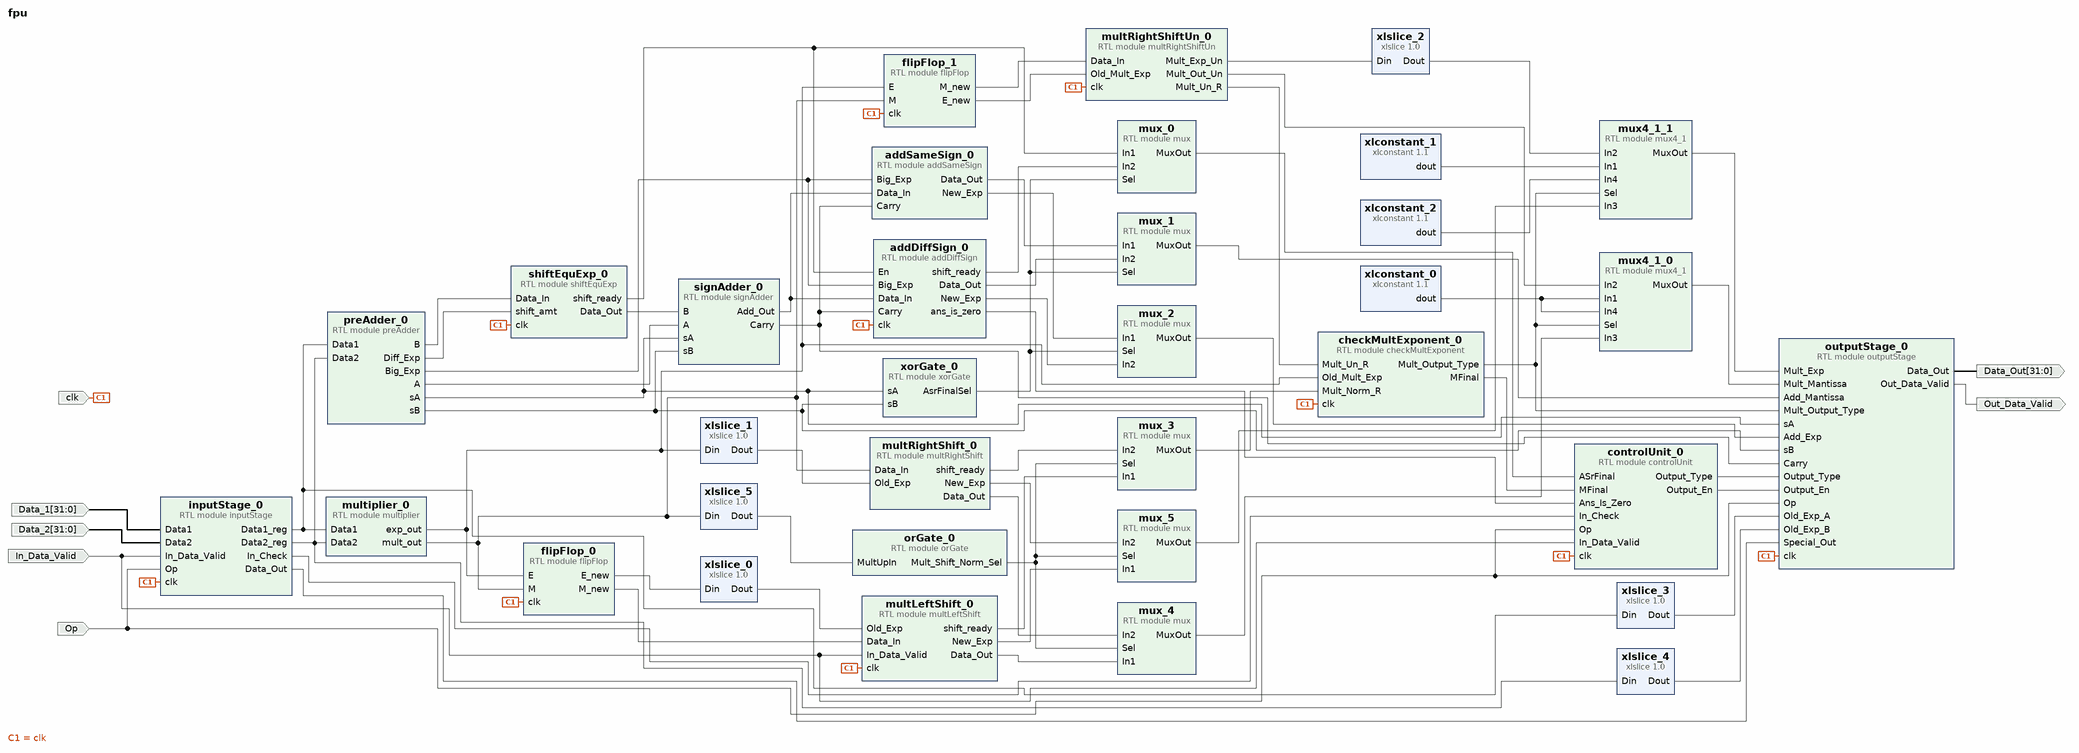
[diagram p0: block diagram of the top level]
# Vivado block design fpu, xc7z020clg400-1, Vivado 2020.2
create_bd_design fpu

create_bd_port -dir I -type clk clk
create_bd_port -dir I -from 31 -to 0 Data_1
create_bd_port -dir I -from 31 -to 0 Data_2
create_bd_port -dir I In_Data_Valid
create_bd_port -dir I Op
create_bd_port -dir O -from 31 -to 0 Data_Out
create_bd_port -dir O Out_Data_Valid

create_bd_cell -type module -reference inputStage inputStage_0
create_bd_cell -type module -reference preAdder preAdder_0
create_bd_cell -type module -reference shiftEquExp shiftEquExp_0
create_bd_cell -type module -reference signAdder signAdder_0
create_bd_cell -type module -reference addDiffSign addDiffSign_0
create_bd_cell -type module -reference addSameSign addSameSign_0
create_bd_cell -type module -reference mux mux_0
set_property -dict {CONFIG.Width 1} [get_bd_cells mux_0]
create_bd_cell -type module -reference mux mux_1
create_bd_cell -type module -reference mux mux_2
set_property -dict {CONFIG.Width 8} [get_bd_cells mux_2]
create_bd_cell -type module -reference controlUnit controlUnit_0
create_bd_cell -type module -reference outputStage outputStage_0
create_bd_cell -type module -reference multiplier multiplier_0
create_bd_cell -type module -reference multLeftShift multLeftShift_0
create_bd_cell -type module -reference multRightShift multRightShift_0
create_bd_cell -type ip -vlnv xilinx.com:ip:xlslice:1.0 xlslice_0
set_property -dict {CONFIG.DIN_FROM 7 CONFIG.DIN_WIDTH 9 CONFIG.DOUT_WIDTH 8} [get_bd_cells xlslice_0]
create_bd_cell -type module -reference mux mux_3
set_property -dict {CONFIG.Width 1} [get_bd_cells mux_3]
create_bd_cell -type module -reference mux mux_4
create_bd_cell -type module -reference mux mux_5
set_property -dict {CONFIG.Width 8} [get_bd_cells mux_5]
create_bd_cell -type module -reference flipFlop flipFlop_0
create_bd_cell -type ip -vlnv xilinx.com:ip:xlslice:1.0 xlslice_1
set_property -dict {CONFIG.DIN_FROM 7 CONFIG.DIN_WIDTH 9 CONFIG.DOUT_WIDTH 8} [get_bd_cells xlslice_1]
create_bd_cell -type module -reference mux4_1 mux4_1_0
create_bd_cell -type module -reference multRightShiftUn multRightShiftUn_0
create_bd_cell -type module -reference flipFlop flipFlop_1
create_bd_cell -type module -reference checkMultExponent checkMultExponent_0
create_bd_cell -type ip -vlnv xilinx.com:ip:xlslice:1.0 xlslice_2
set_property -dict {CONFIG.DIN_FROM 7 CONFIG.DIN_WIDTH 9 CONFIG.DOUT_WIDTH 8} [get_bd_cells xlslice_2]
create_bd_cell -type ip -vlnv xilinx.com:ip:xlconstant:1.1 xlconstant_0
set_property -dict {CONFIG.CONST_VAL 0 CONFIG.CONST_WIDTH 24} [get_bd_cells xlconstant_0]
create_bd_cell -type module -reference mux4_1 mux4_1_1
set_property -dict {CONFIG.Width 8} [get_bd_cells mux4_1_1]
create_bd_cell -type ip -vlnv xilinx.com:ip:xlconstant:1.1 xlconstant_1
set_property -dict {CONFIG.CONST_VAL 0 CONFIG.CONST_WIDTH 8} [get_bd_cells xlconstant_1]
create_bd_cell -type ip -vlnv xilinx.com:ip:xlconstant:1.1 xlconstant_2
set_property -dict {CONFIG.CONST_VAL 255 CONFIG.CONST_WIDTH 8} [get_bd_cells xlconstant_2]
create_bd_cell -type ip -vlnv xilinx.com:ip:xlslice:1.0 xlslice_3
set_property -dict {CONFIG.DIN_FROM 30 CONFIG.DIN_TO 23 CONFIG.DOUT_WIDTH 8} [get_bd_cells xlslice_3]
create_bd_cell -type ip -vlnv xilinx.com:ip:xlslice:1.0 xlslice_4
set_property -dict {CONFIG.DIN_FROM 30 CONFIG.DIN_TO 23 CONFIG.DOUT_WIDTH 8} [get_bd_cells xlslice_4]
create_bd_cell -type ip -vlnv xilinx.com:ip:xlslice:1.0 xlslice_5
set_property -dict {CONFIG.DIN_FROM 47 CONFIG.DIN_TO 46 CONFIG.DIN_WIDTH 48 CONFIG.DOUT_WIDTH 2} [get_bd_cells xlslice_5]
create_bd_cell -type module -reference orGate orGate_0
create_bd_cell -type module -reference xorGate xorGate_0

# ---- connections ----

connect_bd_net [get_bd_pins inputStage_0/Data1_reg] [get_bd_pins preAdder_0/Data1] [get_bd_pins multiplier_0/Data1] [get_bd_pins xlslice_3/Din]
connect_bd_net [get_bd_pins inputStage_0/Data2_reg] [get_bd_pins preAdder_0/Data2] [get_bd_pins multiplier_0/Data2] [get_bd_pins xlslice_4/Din]
connect_bd_net [get_bd_pins preAdder_0/B] [get_bd_pins shiftEquExp_0/Data_In]
connect_bd_net [get_bd_pins preAdder_0/Diff_Exp] [get_bd_pins shiftEquExp_0/shift_amt]
connect_bd_net [get_bd_pins preAdder_0/sA] [get_bd_pins signAdder_0/sA] [get_bd_pins outputStage_0/sA] [get_bd_pins xorGate_0/sA]
connect_bd_net [get_bd_pins preAdder_0/sB] [get_bd_pins signAdder_0/sB] [get_bd_pins outputStage_0/sB] [get_bd_pins xorGate_0/sB]
connect_bd_net [get_bd_pins preAdder_0/A] [get_bd_pins signAdder_0/A]
connect_bd_net [get_bd_pins shiftEquExp_0/Data_Out] [get_bd_pins signAdder_0/B]
connect_bd_net [get_bd_pins shiftEquExp_0/shift_ready] [get_bd_pins addDiffSign_0/En] [get_bd_pins mux_0/In1]
connect_bd_net [get_bd_pins signAdder_0/Carry] [get_bd_pins addDiffSign_0/Carry] [get_bd_pins addSameSign_0/Carry] [get_bd_pins outputStage_0/Carry]
connect_bd_net [get_bd_pins signAdder_0/Add_Out] [get_bd_pins addDiffSign_0/Data_In] [get_bd_pins addSameSign_0/Data_In]
connect_bd_net [get_bd_pins preAdder_0/Big_Exp] [get_bd_pins addDiffSign_0/Big_Exp] [get_bd_pins addSameSign_0/Big_Exp]
connect_bd_net [get_bd_pins addDiffSign_0/shift_ready] [get_bd_pins mux_0/In2]
connect_bd_net [get_bd_pins addSameSign_0/Data_Out] [get_bd_pins mux_1/In1]
connect_bd_net [get_bd_pins addDiffSign_0/Data_Out] [get_bd_pins mux_1/In2]
connect_bd_net [get_bd_pins addSameSign_0/New_Exp] [get_bd_pins mux_2/In1]
connect_bd_net [get_bd_pins addDiffSign_0/New_Exp] [get_bd_pins mux_2/In2]
connect_bd_net [get_bd_pins inputStage_0/In_Check] [get_bd_pins controlUnit_0/In_Check]
connect_bd_net [get_bd_pins addDiffSign_0/ans_is_zero] [get_bd_pins controlUnit_0/Ans_Is_Zero]
connect_bd_net [get_bd_pins mux_0/MuxOut] [get_bd_pins controlUnit_0/ASrFinal]
connect_bd_net [get_bd_pins mux_1/MuxOut] [get_bd_pins outputStage_0/Add_Mantissa]
connect_bd_net [get_bd_pins mux_2/MuxOut] [get_bd_pins outputStage_0/Add_Exp]
connect_bd_net [get_bd_pins controlUnit_0/Output_Type] [get_bd_pins outputStage_0/Output_Type]
connect_bd_net [get_bd_pins controlUnit_0/Output_En] [get_bd_pins outputStage_0/Output_En]
connect_bd_net [get_bd_pins multRightShift_0/shift_ready] [get_bd_pins mux_3/In2]
connect_bd_net [get_bd_pins multLeftShift_0/Data_Out] [get_bd_pins mux_4/In1]
connect_bd_net [get_bd_pins multRightShift_0/Data_Out] [get_bd_pins mux_4/In2]
connect_bd_net [get_bd_pins multLeftShift_0/shift_ready] [get_bd_pins mux_3/In1]
connect_bd_net [get_bd_pins multLeftShift_0/New_Exp] [get_bd_pins mux_5/In1]
connect_bd_net [get_bd_pins multRightShift_0/New_Exp] [get_bd_pins mux_5/In2]
connect_bd_net [get_bd_pins multiplier_0/mult_out] \
  [get_bd_pins flipFlop_0/M] [get_bd_pins multRightShift_0/Data_In] [get_bd_pins flipFlop_1/M] [get_bd_pins xlslice_5/Din]
connect_bd_net [get_bd_pins multiplier_0/exp_out] \
  [get_bd_pins flipFlop_0/E] [get_bd_pins xlslice_1/Din] [get_bd_pins flipFlop_1/E] \
  [get_bd_pins checkMultExponent_0/Old_Mult_Exp]
connect_bd_net [get_bd_pins flipFlop_0/M_new] [get_bd_pins multLeftShift_0/Data_In]
connect_bd_net [get_bd_pins flipFlop_0/E_new] [get_bd_pins xlslice_0/Din]
connect_bd_net [get_bd_pins xlslice_0/Dout] [get_bd_pins multLeftShift_0/Old_Exp]
connect_bd_net [get_bd_pins xlslice_1/Dout] [get_bd_pins multRightShift_0/Old_Exp]
connect_bd_net [get_bd_pins flipFlop_1/M_new] [get_bd_pins multRightShiftUn_0/Data_In]
connect_bd_net [get_bd_pins flipFlop_1/E_new] [get_bd_pins multRightShiftUn_0/Old_Mult_Exp]
connect_bd_net [get_bd_pins mux_3/MuxOut] [get_bd_pins checkMultExponent_0/Mult_Norm_R]
connect_bd_net [get_bd_pins multRightShiftUn_0/Mult_Un_R] [get_bd_pins checkMultExponent_0/Mult_Un_R]
connect_bd_net [get_bd_pins checkMultExponent_0/MFinal] [get_bd_pins controlUnit_0/MFinal]
connect_bd_net [get_bd_pins checkMultExponent_0/Mult_Output_Type] \
  [get_bd_pins mux4_1_0/Sel] [get_bd_pins outputStage_0/Mult_Output_Type] [get_bd_pins mux4_1_1/Sel]
connect_bd_net [get_bd_pins multRightShiftUn_0/Mult_Out_Un] [get_bd_pins mux4_1_0/In2]
connect_bd_net [get_bd_pins multRightShiftUn_0/Mult_Exp_Un] [get_bd_pins xlslice_2/Din]
connect_bd_net [get_bd_pins mux_4/MuxOut] [get_bd_pins mux4_1_0/In3]
connect_bd_net [get_bd_pins xlconstant_0/dout] [get_bd_pins mux4_1_0/In1] [get_bd_pins mux4_1_0/In4]
connect_bd_net [get_bd_pins xlconstant_1/dout] [get_bd_pins mux4_1_1/In1]
connect_bd_net [get_bd_pins xlslice_2/Dout] [get_bd_pins mux4_1_1/In2]
connect_bd_net [get_bd_pins mux_5/MuxOut] [get_bd_pins mux4_1_1/In3]
connect_bd_net [get_bd_pins xlconstant_2/dout] [get_bd_pins mux4_1_1/In4]
connect_bd_net [get_bd_pins mux4_1_1/MuxOut] [get_bd_pins outputStage_0/Mult_Exp]
connect_bd_net [get_bd_pins mux4_1_0/MuxOut] [get_bd_pins outputStage_0/Mult_Mantissa]
connect_bd_net [get_bd_pins inputStage_0/Data_Out] [get_bd_pins outputStage_0/Special_Out]
connect_bd_net [get_bd_pins xlslice_3/Dout] [get_bd_pins outputStage_0/Old_Exp_A]
connect_bd_net [get_bd_pins xlslice_4/Dout] [get_bd_pins outputStage_0/Old_Exp_B]
connect_bd_net [get_bd_pins xlslice_5/Dout] [get_bd_pins orGate_0/MultUpIn]
connect_bd_net [get_bd_pins orGate_0/Mult_Shift_Norm_Sel] [get_bd_pins mux_3/Sel] [get_bd_pins mux_4/Sel] [get_bd_pins mux_5/Sel]
connect_bd_net [get_bd_pins xorGate_0/AsrFinalSel] [get_bd_pins mux_1/Sel] [get_bd_pins mux_2/Sel] [get_bd_pins mux_0/Sel]
connect_bd_net -net clk_0_1 [get_bd_ports clk] \
  [get_bd_pins inputStage_0/clk] [get_bd_pins flipFlop_0/clk] [get_bd_pins flipFlop_1/clk] \
  [get_bd_pins multRightShiftUn_0/clk] [get_bd_pins multLeftShift_0/clk] [get_bd_pins checkMultExponent_0/clk] \
  [get_bd_pins controlUnit_0/clk] [get_bd_pins outputStage_0/clk] [get_bd_pins shiftEquExp_0/clk] \
  [get_bd_pins addDiffSign_0/clk]
connect_bd_net -net Data1_0_1 [get_bd_ports Data_1] [get_bd_pins inputStage_0/Data1]
connect_bd_net -net Data2_0_1 [get_bd_ports Data_2] [get_bd_pins inputStage_0/Data2]
connect_bd_net -net In_Data_Valid_0_1 [get_bd_ports In_Data_Valid] \
  [get_bd_pins inputStage_0/In_Data_Valid] [get_bd_pins controlUnit_0/In_Data_Valid] \
  [get_bd_pins multLeftShift_0/In_Data_Valid]
connect_bd_net -net Op_0_1 [get_bd_ports Op] [get_bd_pins inputStage_0/Op] [get_bd_pins outputStage_0/Op] [get_bd_pins controlUnit_0/Op]
connect_bd_net [get_bd_pins outputStage_0/Data_Out] [get_bd_ports Data_Out]
connect_bd_net [get_bd_pins outputStage_0/Out_Data_Valid] [get_bd_ports Out_Data_Valid]

validate_bd_design
save_bd_design
